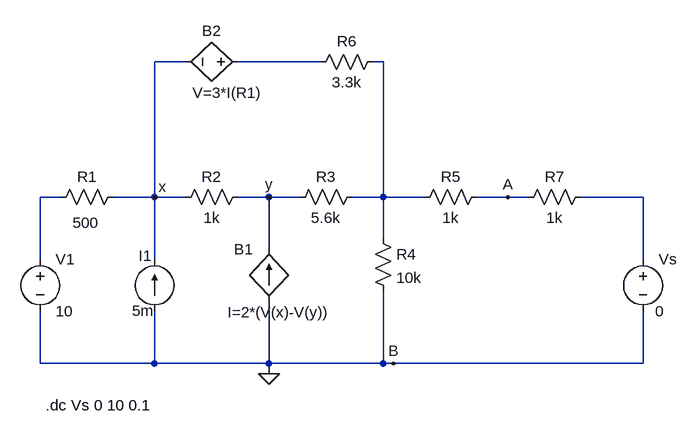
[diagram p0: schematic ivchar.asc]
ivchar.asc, the LTspice schematic file:
Version 4
SHEET 1 1080 680
WIRE 320 -48 272 -48
WIRE 528 -48 400 -48
WIRE 624 -48 608 -48
WIRE 128 160 96 160
WIRE 272 160 272 -48
WIRE 272 160 208 160
WIRE 320 160 272 160
WIRE 448 160 400 160
WIRE 496 160 448 160
WIRE 624 160 624 -48
WIRE 624 160 576 160
WIRE 688 160 624 160
WIRE 816 160 768 160
WIRE 848 160 816 160
WIRE 1024 160 928 160
WIRE 624 224 624 160
WIRE 448 240 448 160
WIRE 96 256 96 160
WIRE 272 256 272 160
WIRE 1024 256 1024 160
WIRE 96 416 96 336
WIRE 272 416 272 336
WIRE 272 416 96 416
WIRE 448 416 448 320
WIRE 448 416 272 416
WIRE 624 416 624 304
WIRE 624 416 448 416
WIRE 640 416 624 416
WIRE 1024 416 1024 336
WIRE 1024 416 640 416
WIRE 448 432 448 416
FLAG 448 432 0
FLAG 640 416 B
FLAG 272 160 x
FLAG 448 160 y
FLAG 816 160 A
SYMBOL res 224 144 R90
WINDOW 0 0 56 VBottom 2
WINDOW 3 40 58 VTop 2
SYMATTR InstName R1
SYMATTR Value 500
SYMBOL res 416 144 R90
WINDOW 0 0 56 VBottom 2
WINDOW 3 32 56 VTop 2
SYMATTR InstName R2
SYMATTR Value 1k
SYMBOL res 592 144 R90
WINDOW 0 0 56 VBottom 2
WINDOW 3 32 56 VTop 2
SYMATTR InstName R3
SYMATTR Value 5.6k
SYMBOL res 608 208 R0
SYMATTR InstName R4
SYMATTR Value 10k
SYMBOL res 672 176 R270
WINDOW 0 32 56 VTop 2
WINDOW 3 0 56 VBottom 2
SYMATTR InstName R5
SYMATTR Value 1k
SYMBOL voltage 96 240 R0
WINDOW 123 0 0 Left 0
WINDOW 39 0 0 Left 0
SYMATTR InstName V1
SYMATTR Value 10
SYMBOL current 272 336 R180
WINDOW 0 4 86 Left 2
WINDOW 3 1 1 Left 2
SYMATTR InstName I1
SYMATTR Value 5m
SYMBOL res 624 -64 R90
WINDOW 0 0 56 VBottom 2
WINDOW 3 32 56 VTop 2
SYMATTR InstName R6
SYMATTR Value 3.3k
SYMBOL bi 448 320 R180
WINDOW 0 24 80 Left 2
WINDOW 3 -93 -17 Left 2
SYMATTR InstName B1
SYMATTR Value I=2*(V(x)-V(y))
SYMBOL bv 416 -48 R90
WINDOW 0 -32 56 VBottom 2
WINDOW 3 32 32 VTop 2
SYMATTR InstName B2
SYMATTR Value V=3*I(R1)
SYMBOL res 944 144 R90
WINDOW 0 0 56 VBottom 2
WINDOW 3 32 56 VTop 2
SYMATTR InstName R7
SYMATTR Value 1k
SYMBOL voltage 1024 240 R0
WINDOW 3 19 96 Left 2
WINDOW 123 0 0 Left 0
WINDOW 39 0 0 Left 0
SYMATTR InstName Vs
SYMATTR Value 0
TEXT 104 480 Left 2 !.dc Vs 0 10 0.1

The netlist it stands for:
* ivchar.asc
R1 x N003 500
R2 y x 1k
R3 N002 y 5.6k
R4 N002 0 10k
R5 N002 A 1k
V1 N003 0 10
I1 0 x 5m
R6 N002 N001 3.3k
B1 0 y I=2*(V(x)-V(y))
B2 N001 x V=3*I(R1)
R7 N004 A 1k
Vs N004 0 0
.dc Vs 0 10 0.1
.backanno
.end

* Results of the author's LTspice run, read from the files saved beside the schematic
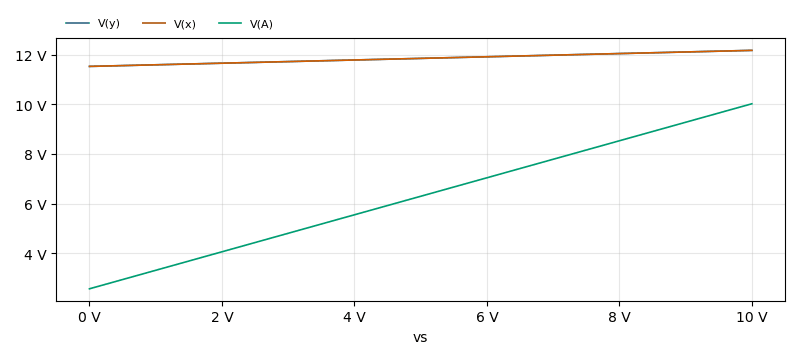
[diagram p1: DC transfer characteristic of ivchar.asc, plotted from the saved traces]
* DC transfer characteristic, 1 run:
*   V(y): 11.53 V at vs=0 V, 12.18 V at vs=10 V, min 11.53 V, max 12.18 V
*   V(x): 11.53 V at vs=0 V, 12.18 V at vs=10 V, min 11.53 V, max 12.18 V
*   V(A): 2.568 V at vs=0 V, 10.02 V at vs=10 V, min 2.568 V, max 10.02 V